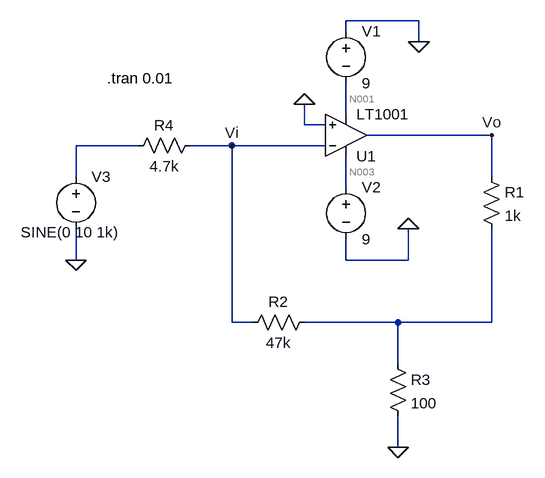
[diagram p0: schematic Op-Amp feedback (CCCS).asc]
Op-Amp feedback (CCCS).asc, the LTspice schematic file:
Version 4
SHEET 1 880 680
WIRE 336 -48 224 -48
WIRE 224 -32 224 -48
WIRE 336 -16 336 -48
WIRE 224 96 224 48
WIRE 160 112 160 80
WIRE 192 112 160 112
WIRE 448 128 256 128
WIRE -96 144 -192 144
WIRE 48 144 -16 144
WIRE 192 144 48 144
WIRE -192 192 -192 144
WIRE 448 192 448 128
WIRE 224 208 224 160
WIRE -192 320 -192 272
WIRE 224 320 224 288
WIRE 320 320 320 272
WIRE 320 320 224 320
WIRE 48 416 48 144
WIRE 80 416 48 416
WIRE 304 416 160 416
WIRE 448 416 448 272
WIRE 448 416 304 416
WIRE 304 480 304 416
WIRE 304 608 304 560
FLAG 160 80 0
FLAG 336 -16 0
FLAG 320 272 0
FLAG 304 608 0
FLAG -192 320 0
FLAG 448 128 Vo
FLAG 48 144 Vi
SYMBOL OpAmps\\LT1001 224 192 M180
SYMATTR InstName U1
SYMBOL voltage 224 -48 R0
SYMATTR InstName V1
SYMATTR Value 9
SYMBOL voltage 224 192 R0
SYMATTR InstName V2
SYMATTR Value 9
SYMBOL voltage -192 176 R0
WINDOW 3 -85 101 Left 2
WINDOW 123 0 0 Left 0
WINDOW 39 0 0 Left 0
SYMATTR Value SINE(0 10 1k)
SYMATTR InstName V3
SYMBOL res 432 176 R0
SYMATTR InstName R1
SYMATTR Value 1k
SYMBOL res 176 400 R90
WINDOW 0 0 56 VBottom 2
WINDOW 3 32 56 VTop 2
SYMATTR InstName R2
SYMATTR Value 47k
SYMBOL res 288 464 R0
SYMATTR InstName R3
SYMATTR Value 100
SYMBOL res 0 128 R90
WINDOW 0 0 56 VBottom 2
WINDOW 3 32 56 VTop 2
SYMATTR InstName R4
SYMATTR Value 4.7k
TEXT -144 40 Left 2 !.tran 0.01

The netlist it stands for:
* Op-Amp feedback (CCCS).asc
XU1 0 Vi N003 N001 Vo LT1001  ; pins In+ In- V+ V- OUT
V1 0 N001 9
V2 N003 0 9
V3 N002 0 SINE(0 10 1k)
R1 Vo N004 1k
R2 N004 Vi 47k
R3 N004 0 100
R4 Vi N002 4.7k
.tran 0.01
.lib LTC.lib
.backanno
.end

* Results of the author's LTspice run, read from the files saved beside the schematic
* Operating Point, zero values left out:
*   V(n003) = 9 V
*   V(n001) = -9 V
*   I(V2) = -2.25 mA
*   I(V1) = -2.25 mA
*   Ix(u1:3) = 2.25 mA
*   Ix(u1:4) = -2.25 mA
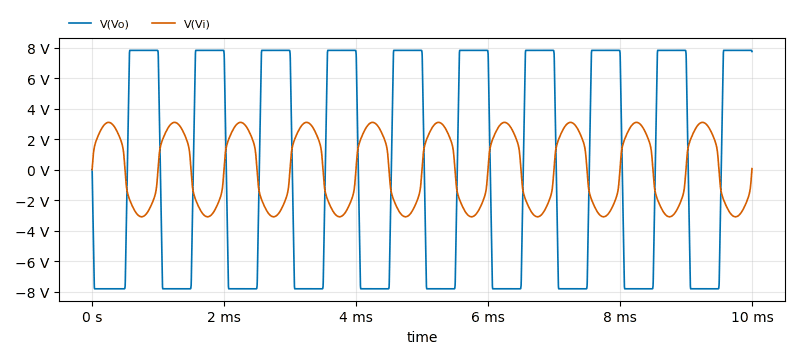
[diagram p1: Transient Analysis of Op-Amp feedback (CCCS).asc, plotted from the saved traces]
* Transient Analysis, 1 run:
*   V(Vo): min -7.814 V, max 7.814 V, average -39.22 mV, rms 7.479 V, last 7.739 V
*   V(Vi): min -3.094 V, max 3.094 V, average -71.07 µV, rms 2.435 V, last 63.06 mV